# EasyEDA Pro project ICEDA_Osptek ST7306 Display Driver Board.epro

# Schematic Schematic1
Board Name: Board1; Create Date: 2025-10-27; Page Name: P1; Project Name: Ospyek ST7305 Display Driver Board; Schematic Name: Schematic1; Update Date: 2025-10-31; Company: 嘉立创EDA; Page Size: A4; Version: V1.0
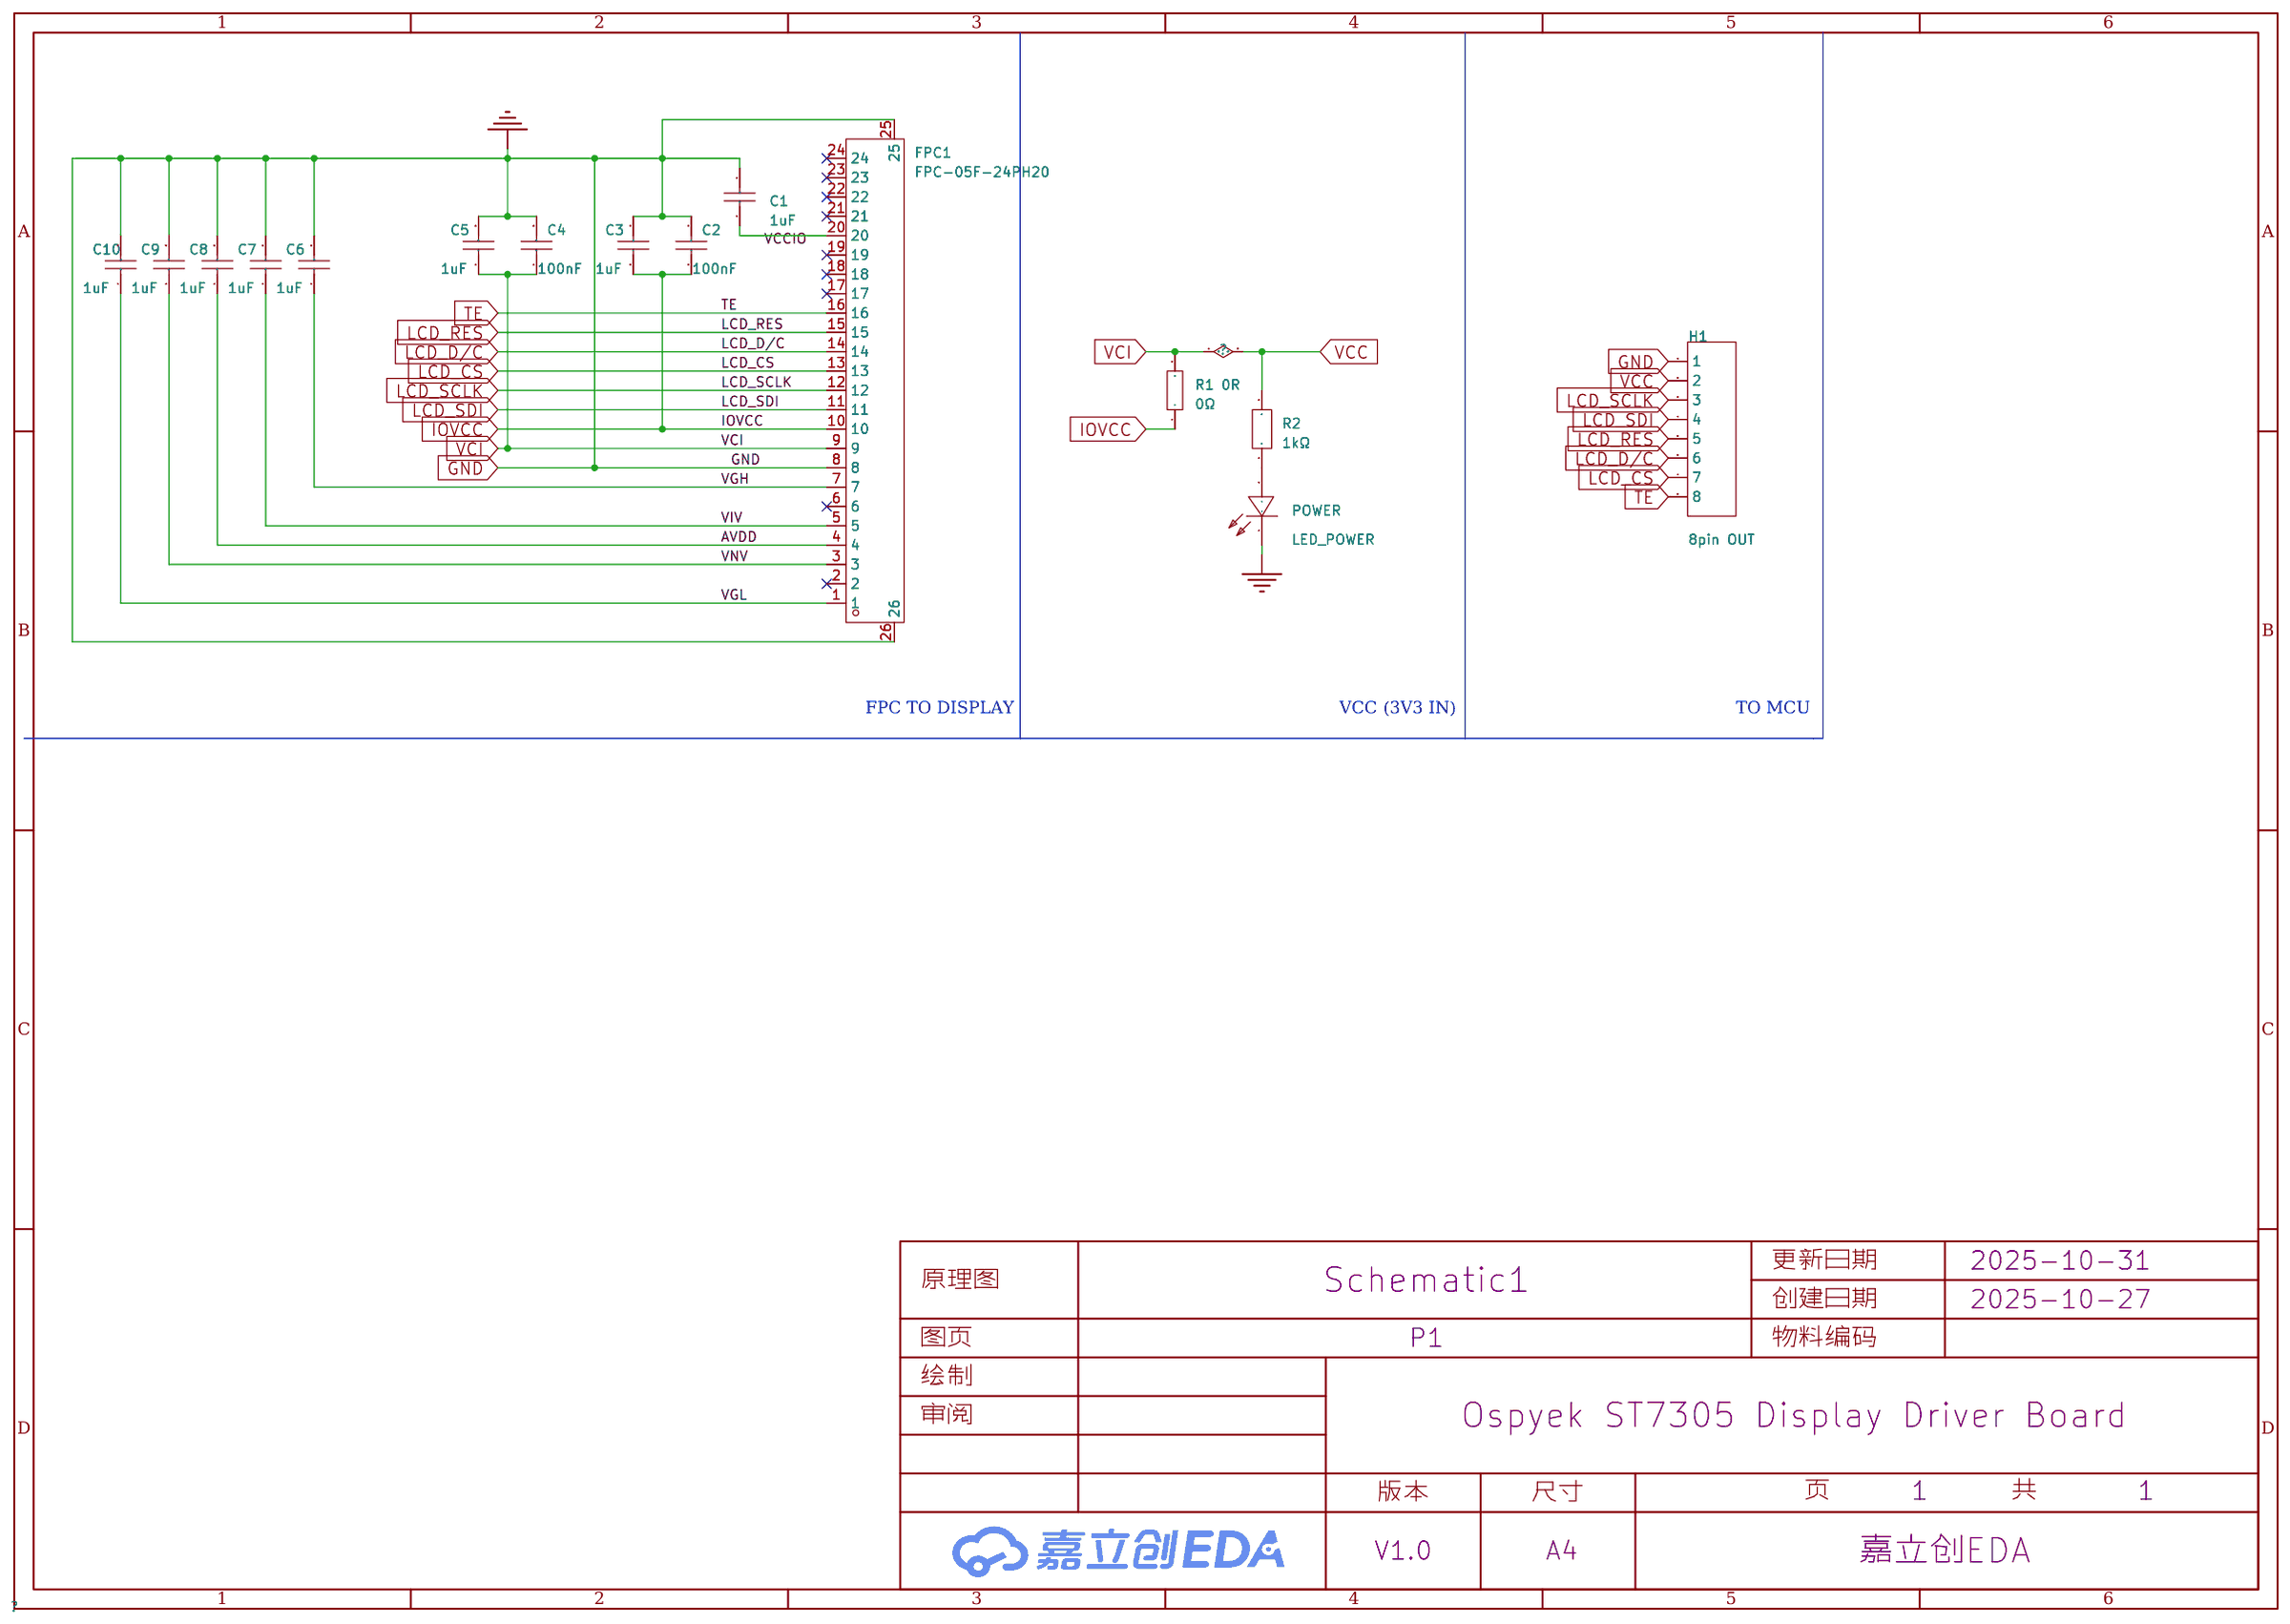
[diagram p0: schematic sheet]

## Parts
C1  1uF  [C0603]
C2  100nF  [C0603]
C3  1uF  [C0603]
C4  100nF  [C0603]
C5  1uF  [C0603]
C6  1uF  [C0603]
C7  1uF  [C0603]
C8  1uF  [C0603]
C9  1uF  [C0603]
C10  1uF  [C0603]
FPC1  FPC-05F-24PH20  [FPC-SMD_24P-P0.50_FPC-05F-24PH20]
H1  8pin OUT  [HDR-TH_8P-P2.54-V-M]
POWER  LED_POWER  [LED0603-RD-YELLOW]
R1 0R  0Ω  [R0805]
R2  1kΩ  [R0805]

## Library data of the parts
C1 C3 C5-C10 = CL10B105KA8NNNC: 容值:1uF;精度:±10%;额定电压:25V;温度系数:X7R;; LCSC Part Name: 1uF ±10% 25V; Supplier Part: C29936; Manufacturer: SAMSUNG(三星); Supplier Footprint: 0603; JLCPCB Part Class: 扩展库; Datasheet: https://item.szlcsc.com/datasheet/CL10B105KA8NNNC/30690.html; Supplier: LCSC; Tolerance: ±10%; Voltage Rating: 25V; Temperature Coefficient: X7R
C2 C4 = 0603B104K500NT: 容值:100nF;精度:±10%;额定电压:50V;温度系数:X7R;; LCSC Part Name: 100nF ±10% 50V; Supplier Part: C30926; Manufacturer: FH(风华); Supplier Footprint: 0603; JLCPCB Part Class: 扩展库; Datasheet: https://item.szlcsc.com/datasheet/0603B104K500NT/31683.html; Supplier: LCSC; Tolerance: ±10%; Voltage Rating: 50V; Temperature Coefficient: X7R
FPC1 = FPC-05F-24PH20: 锁定特性:翻盖式;触点类型:卧贴;触点数量:24P;间距:0.5mm;安装方式:下接;工作温度:-25℃~+85℃;; LCSC Part Name: 翻盖式 卧贴 P数:24P 间距:0.5mm; Supplier Part: C2856805; Manufacturer: XUNPU(讯普); Supplier Footprint: SMD,P=0.5mm,卧贴; JLCPCB Part Class: 扩展库; Datasheet: https://item.szlcsc.com/datasheet/FPC-05F-24PH20/3056903.html; Supplier: LCSC; Locking Feature: 翻盖式; Contact Type: 卧贴; Number of Contacts: 24P; Pitch: 0.5mm; Mounting Type: 下接; FFC, FCB Thickness: 0.3mm; Height Above Board: 2mm; Contact Material: 磷青铜; Contact Plating: 锡; Operating Temperature: -25℃~+85℃; Rated Voltage (Max): 50V; Current Rating (Max): 500mA
H1 = B-2100S08P-A110: 插针结构:1x8P;间距:2.54mm;行距:-;圆针/方针:-;安装方式:直插;排数:单排;总PIN位数:8P;额定电流:-;额定电压:-;配合针长度:6mm;塑高:2.54mm;端接针长度:3mm;触头材质:黄铜;触头镀层:-;工作温度:-40℃~+105℃;颜色:黑色;; LCSC Part Name: 1x8P 间距:2.54mm 直插; Supplier Part: C124381; Manufacturer: Ckmtw(灿科盟); Supplier Footprint: 插件,P=2.54mm; JLCPCB Part Class: 扩展库; Datasheet: https://item.szlcsc.com/datasheet/B-2100S08P-A110/125656.html; Supplier: LCSC; Pin Structure: 1x8P; Pitch: 2.54mm; Mounting Type: 直插; Number of Rows: 单排; Number of Pins: 8P; Length of Mating Pin: 6mm; Insulation Height: 2.54mm; Length of End Connection Pin: 3mm; Contact Material: 黄铜; Operating Temperature: -40℃~+105℃; Color: 黑色
POWER = LTST-C191KSKT: 发光颜色:黄色;正向压降(Vf):2.1V;功率:75mW;正向电流:20mA;波长:584.5nm~597nm;二极管配置:-;透镜颜色:无色透明透镜;色温:-;发光强度:104mcd;发光角度:130°;载带方式:-;工作温度:-55℃~+85℃;; LCSC Part Name: 黄灯; Supplier Part: C125100; Manufacturer: LITEON(光宝); Supplier Footprint: 0603; JLCPCB Part Class: 扩展库; Datasheet: https://item.szlcsc.com/datasheet/LTST-C191KSKT/136376.html; Supplier: LCSC; Illumination Color: 黄色; Voltage - Forward(Vf): 2.1V; Power(Watts): 75mW; Forward Current: 20mA; Wavelength - Dominant: 584.5nm~597nm; Peak Wavelength: 588nm; Lens Color: 无色透明透镜; Luminous Intensity: 104mcd; Viewing Angle: 130°; Operating Temperature: -55℃~+85℃
R1 0R = 0805W8F0000T5E: 电阻类型:厚膜电阻;阻值:0Ω;精度:±1%;功率:125mW;工作电压:150V;温度系数:±800ppm/℃;; LCSC Part Name: 0Ω ±1% 125mW 厚膜电阻; Supplier Part: C17477; Manufacturer: UNI-ROYAL(厚声); Supplier Footprint: 0805; JLCPCB Part Class: 基础库; Datasheet: https://item.szlcsc.com/datasheet/0805W8F0000T5E/18165.html; Supplier: LCSC; Type: 厚膜电阻; Tolerance: ±1%; Power(Watts): 125mW; Voltage-Supply(Max): 150V; Temperature Coefficient: ±800ppm/℃; Operating Temperature: -55℃~+155℃
R2 = FRR0805J102 TS: 电阻类型:厚膜电阻;阻值:1kΩ;精度:±5%;功率:125mW;工作电压:150V;温度系数:±100ppm/℃;; LCSC Part Name: 厚膜电阻 0805 1KΩ ±5% 125mW; Supplier Part: C49196827; Manufacturer: FOJAN(富捷); Supplier Footprint: 0805; JLCPCB Part Class: 扩展库; Datasheet: https://item.szlcsc.com/datasheet/FRR0805J102%2520TS/51599075.html; Supplier: LCSC; Type: 厚膜电阻; Tolerance: ±5%; Power(Watts): 125mW; Voltage-Supply(Max): 150V; Temperature Coefficient: ±100ppm/℃; Operating Temperature: -55℃~+155℃

## Nets
AVDD: C8.1 FPC1.4
GND: C1.2 C2.2 C3.2 C4.2 C5.2 C6.2 C7.2 C8.2 C9.2 C10.2 FPC1.8 FPC1.25 FPC1.26 H1.1 POWER.1(-)
VCC: C4.1 C5.1 FPC1.9 H1.2 R1 0R.2 R2.2
VCCIO: C1.1 FPC1.20
IOVCC: C2.1 C3.1 FPC1.10 R1 0R.1
LCD_CS: FPC1.13 H1.7
LCD_D/C: FPC1.14 H1.6
LCD_RES: FPC1.15 H1.5
LCD_SCLK: FPC1.12 H1.3
LCD_SDI: FPC1.11 H1.4
TE: FPC1.16 H1.8
VGH: C6.1 FPC1.7
VGL: C10.1 FPC1.1
VIV: C7.1 FPC1.5
VNV: C9.1 FPC1.3
$1N4245: POWER.2(+) R2.1

Not connected (* = marked no-connect by the designer): FPC1 2* 6* 17* 18* 19* 21* 22* 23* 24*

## Notes on the sheet
- FPC TO DISPLAY
- VCC (3V3 IN)
- TO MCU

# Board PCB1
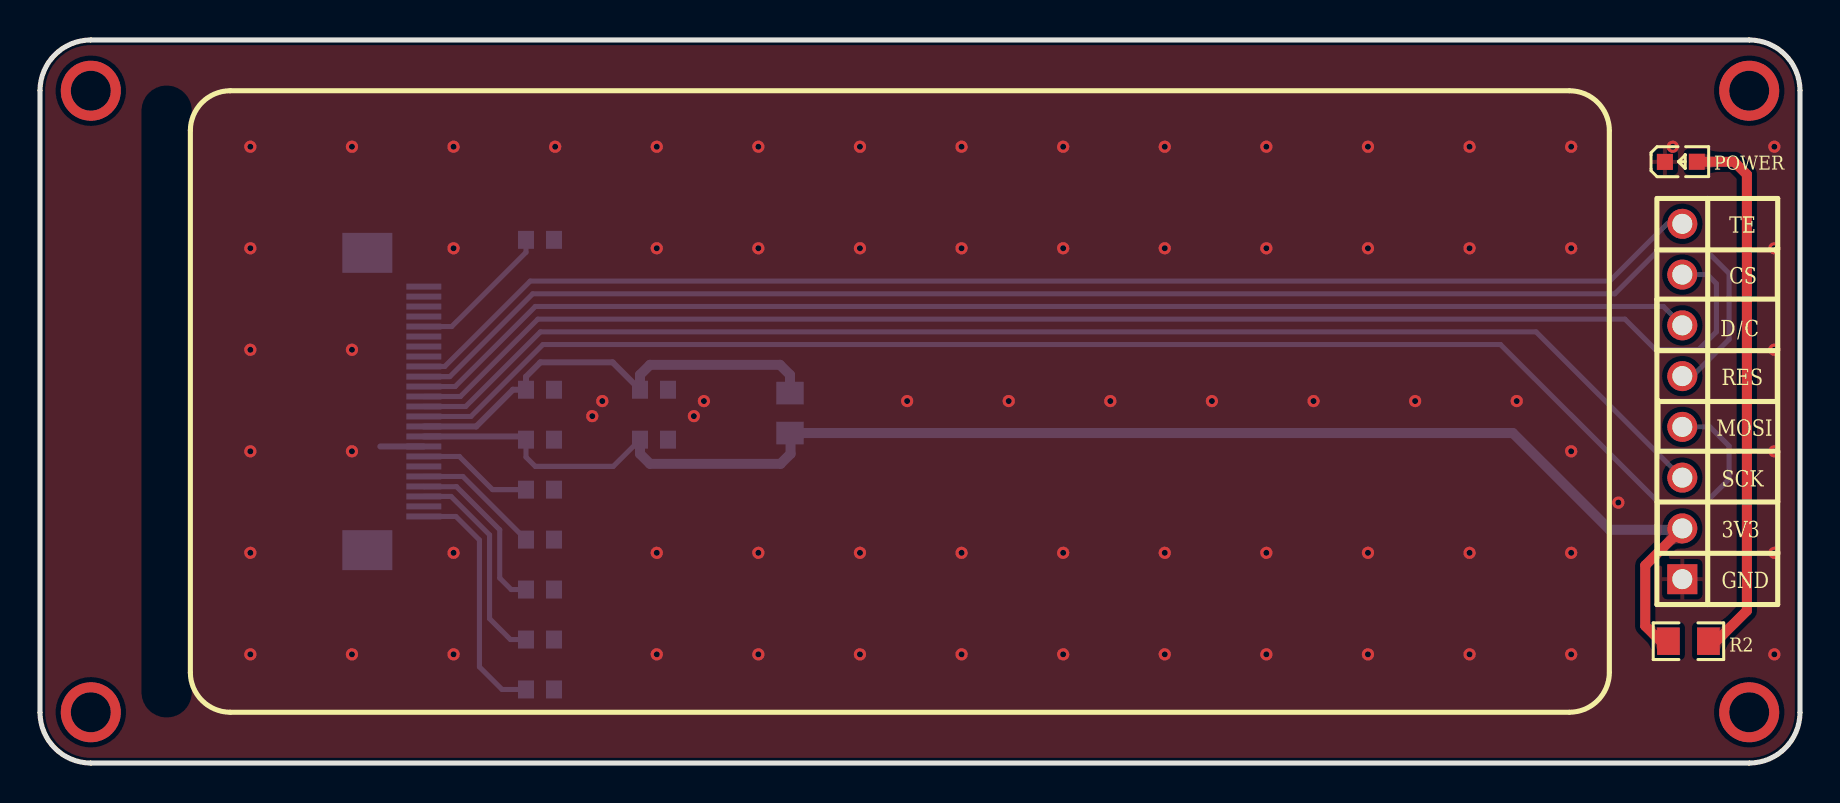
[diagram p1: board, top side]
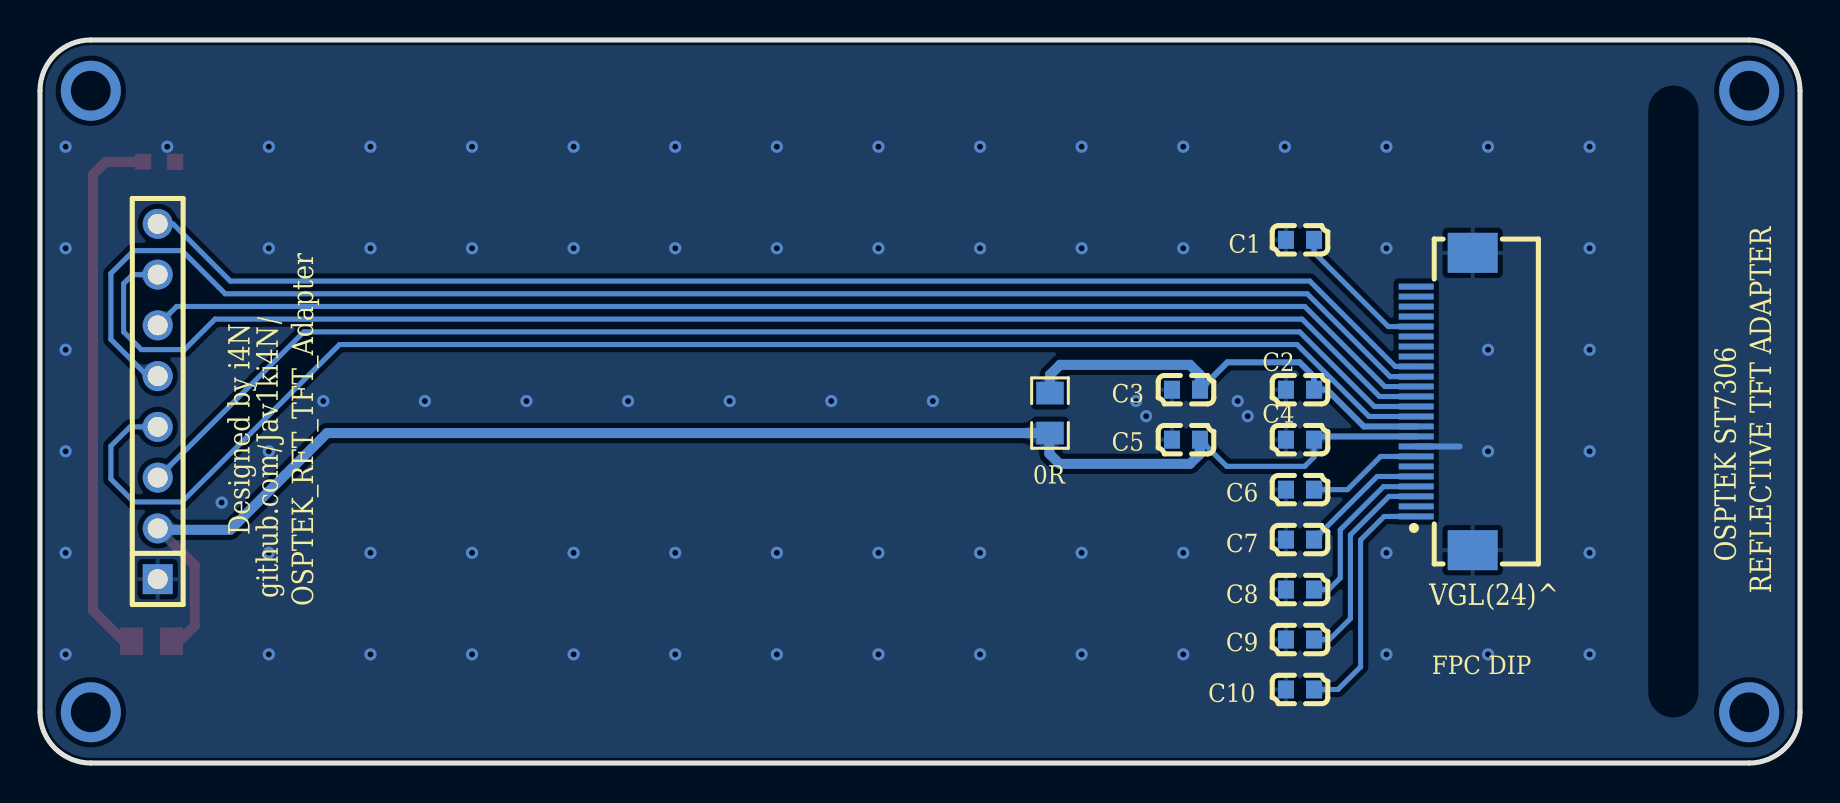
[diagram p2: board, bottom side, seen from below]

Outline 88 x 36.18 mm; copper layers: Top Layer, Bottom Layer. Coordinates in mm from the lower left corner of the outline.
Outline path: 0,33.64 0,2.54 arc(0.74,0.74) 2.54,0 85.46,0 arc(87.26,0.74) 88,2.54 88,33.64 arc(87.26,35.44) 85.46,36.18 2.54,36.18 arc(0.74,35.44) 0,33.64
Stack: Top Layer 0.035mm / Dielectric1 1.51mm FR4 er 4.5 / Bottom Layer 0.035mm

## Design rules (mm)
template: JLCPCB Capability(Two Layers Board)
spacing copperThickness1oz (default): track to track 0.102, other pairs 0.152 to 0.3
spacing copperThickness2oz: track to track 0.203, other pairs 0.152 to 0.3
track width copperThickness1oz (default): min 0.127, default 0.254, max 2.54
track width copperThickness2oz: min 0.203, default 0.254, max 2.54
differential pair differentialPair (default): width min 0.127, default 0.254, max 2.54; gap min 0.152, default 0.152
via viaSize (default): diameter min 0.5, default 0.61, max 10; hole min 0.3, default 0.305, max 6.3

## Placement (name value [footprint] x y rotation side)
0R  -  [R0805]  37.5 17.51 270 bottom
C1  1uF  [C0603]  25 26.18 0 bottom
C2  100nF  [C0603]  25 18.68 0 bottom
C3  1uF  [C0603]  30.7 18.68 0 bottom
C4  100nF  [C0603]  25 16.18 0 bottom
C5  1uF  [C0603]  30.7 16.18 0 bottom
C6  1uF  [C0603]  25 13.68 0 bottom
C7  1uF  [C0603]  25 11.18 0 bottom
C8  1uF  [C0603]  25 8.68 0 bottom
C9  1uF  [C0603]  25 6.18 0 bottom
C10  1uF  [C0603]  25 3.68 0 bottom
FPC DIP
  -  [FPC-SMD_24P-P0.50_FPC-05F-24PH20]  17.65 18.09 90 bottom
H1  8pin OUT  [HDR-TH_8P-P2.54-V-M]  82.12 18.09 90 bottom
POWER  LED_POWER  [LED0603-RD-YELLOW]  82.04 30.08 0 top
R2  1kΩ  [R0805]  82.42 6.1 180 top

## Footprints (pads in the part's own frame, mm; a bottom-side part is the same pattern mirrored in y, then rotated)
C0603
  rect 0.8x0.9 smd: 1(-0.7,0) 2(0.7,0)
FPC-SMD_24P-P0.50_FPC-05F-24PH20
  rect 0.3x1.75 smd: 1(-5.753,1.536) 2(-5.25,1.537) 3(-4.75,1.537) 4(-4.25,1.537) 5(-3.75,1.537) 6(-3.25,1.537) 7(-2.75,1.537) 8(-2.25,1.537) 9(-1.75,1.537) 10(-1.25,1.537) 11(-0.75,1.537) 12(-0.25,1.537) 13(0.25,1.537) 14(0.75,1.537) 15(1.244,1.537) 16(1.752,1.537) 17(2.25,1.537) 18(2.75,1.537) 19(3.25,1.537) 20(3.75,1.537) 21(4.25,1.537) 22(4.75,1.537) 23(5.25,1.537) 24(5.75,1.537)
  rect 2x2.5 smd: 25(7.44,-1.288) 26(-7.44,-1.288)
HDR-TH_8P-P2.54-V-M
  rect 1.5x1.5 hole 1: 1(-8.89,0)
  round 1.5 hole 1: 2(-6.35,0) 3(-3.81,0) 4(-1.27,0) 5(1.27,0) 6(3.81,0) 7(6.35,0) 8(8.89,0)
LED0603-RD-YELLOW
  rect 0.8x0.8 smd: 1(-0.799,-0.004) 2(0.799,0.004)
R0805
  rect 1.133x1.377 smd: 1(-1,0) 2(1,0)

## Nets
AVDD: C8.1 FPC DIP
.4
GND: C1.2 C2.2 C3.2 C4.2 C5.2 C6.2 C7.2 C8.2 C9.2 C10.2 FPC DIP
.8 FPC DIP
.25 FPC DIP
.26 H1.1 POWER.1
VCC: 0R.2 C4.1 C5.1 FPC DIP
.9 H1.2 R2.2
VCCIO: C1.1 FPC DIP
.20
IOVCC: 0R.1 C2.1 C3.1 FPC DIP
.10
LCD_CS: FPC DIP
.13 H1.7
LCD_D/C: FPC DIP
.14 H1.6
LCD_RES: FPC DIP
.15 H1.5
LCD_SCLK: FPC DIP
.12 H1.3
LCD_SDI: FPC DIP
.11 H1.4
TE: FPC DIP
.16 H1.8
VGH: C6.1 FPC DIP
.7
VGL: C10.1 FPC DIP
.1
VIV: C7.1 FPC DIP
.5
VNV: C9.1 FPC DIP
.3
$1N4245: POWER.2 R2.1

Pads without a net: FPC DIP
 2 6 17 18 19 21 22 23 24

## Via types
v1: diameter 3, hole 2, Top Layer to Bottom Layer, 4 vias
v2: diameter 0.61, hole 0.305, Top Layer to Bottom Layer, 75 vias

## Routing (per net, layer and track width the routed paths; a pad name or vN(x,y) marks a point on that pad's centre or on a via; arc(x,y) is an arc through that point)
AVDD: length 8.7
  Bottom Layer w0.254: FPC DIP
.4 19.2,13.83 20.83,13.83 22.99,11.67 22.99,9.26 23.56,8.68 C8.1
GND: length 2.2
  Bottom Layer w0.3: FPC DIP
.8 17.02,15.84
  vias: v2(10.52,30.84) v2(10.52,25.76) v2(10.52,20.68) v2(10.52,15.6) v2(10.52,10.52) v2(10.52,5.44) v2(15.6,30.84) v2(15.6,20.68) v2(15.6,15.6) v2(15.6,5.44) v2(20.68,30.84) v2(20.68,25.76) v2(20.68,10.52) v2(20.68,5.44) v2(25.76,30.84) v2(27.61,17.36) v2(28.12,18.11) v2(30.84,30.84) v2(30.84,25.76) v2(30.84,10.52) v2(30.84,5.44) v2(32.69,17.36) v2(33.2,18.11) v2(35.92,30.84) v2(35.92,25.76) v2(35.92,10.52) v2(35.92,5.44) v2(41,30.84) v2(41,25.76) v2(41,10.52) v2(41,5.44) v2(43.36,18.11) v2(46.08,30.84) v2(46.08,25.76) v2(46.08,10.52) v2(46.08,5.44) v2(48.44,18.11) v2(51.16,30.84) v2(51.16,25.76) v2(51.16,10.52) v2(51.16,5.44) v2(53.52,18.11) v2(56.24,30.84) v2(56.24,25.76) v2(56.24,10.52) v2(56.24,5.44) v2(58.6,18.11) v2(61.32,30.84) v2(61.32,25.76) v2(61.32,10.52) v2(61.32,5.44) v2(63.68,18.11) v2(66.4,30.84) v2(66.4,25.76) v2(66.4,10.52) v2(66.4,5.44) v2(68.76,18.11) v2(71.48,30.84) v2(71.48,25.76) v2(71.48,10.52) v2(71.48,5.44) v2(73.84,18.11) v2(76.56,30.84) v2(76.56,25.76) v2(76.56,15.6) v2(76.56,10.52) v2(76.56,5.44) v2(78.92,13.03) v2(81.64,30.84) v2(86.72,30.84) v2(86.72,25.76) v2(86.72,20.68) v2(86.72,15.6) v2(86.72,10.52) v2(86.72,5.44)
VCC: length 76.1
  Top Layer w0.5: 82.11,11.74 80.26,9.89 80.26,6.86 81.42,5.7
  Bottom Layer w0.254: C5.1 28.66,14.84 24.77,14.84 24.3,15.31 C4.1
  Bottom Layer w0.3: C4.1 24.14,16.34 FPC DIP
.9
  Bottom Layer w0.5: H1.2 82.04,11.67 78.49,11.67 73.64,16.51 0R.2 37.53,16.48 37.53,15.47 37.03,14.97 30.5,14.97 30,15.47 C5.1
VCCIO: length 7.3
  Bottom Layer w0.254: C1.1 24.3,25.56 20.58,21.84 FPC DIP
.20
(no net):
  vias: v1(2.54,33.64) v1(2.54,2.54) v1(85.46,33.64) v1(85.46,2.54)
IOVCC: length 22.7
  Bottom Layer w0.3: C3.1 28.63,20.05 25.02,20.05 24.3,19.33 C2.1 23.65,18.68 21.81,16.84 FPC DIP
.10
  Bottom Layer w0.5: C3.1 30,19.42 30.5,19.92 37,19.92 37.5,19.42 0R.1
LCD_CS: length 71.5
  Bottom Layer w0.254: FPC DIP
.13 21.02,18.34 24.89,22.21 79.25,22.21 80.77,20.69 82.93,20.69 83.82,21.58 83.82,23.99 83.37,24.44 H1.7
LCD_D/C: length 65
  Bottom Layer w0.254: H1.6 81.17,22.85 24.77,22.85 20.76,18.84 FPC DIP
.14
LCD_RES: length 74.7
  Bottom Layer w0.254: H1.5 82.62,19.36 84.46,21.2 84.46,24.5 83.31,25.64 80.9,25.64 78.74,23.48 24.64,23.48 20.49,19.33 FPC DIP
.15
LCD_SCLK: length 67.5
  Bottom Layer w0.254: FPC DIP
.12 21.28,17.84 25.02,21.58 74.8,21.58 82.1,14.28 H1.3
LCD_SDI: length 74.9
  Bottom Layer w0.254: H1.4 83.5,16.82 84.46,15.86 84.46,14.21 83.31,13.07 80.9,13.07 73.03,20.94 25.15,20.94 21.55,17.34 FPC DIP
.11
TE: length 65.9
  Bottom Layer w0.254: H1.8 81.35,26.98 78.49,24.12 24.51,24.12 20.24,19.84 FPC DIP
.16
VGH: length 5.8
  Bottom Layer w0.254: C6.1 22.63,13.68 20.97,15.34 FPC DIP
.7
VGL: length 12.4
  Bottom Layer w0.254: C10.1 23.1,3.68 21.97,4.81 21.97,11.16 20.8,12.34 FPC DIP
.1
VIV: length 6.4
  Bottom Layer w0.254: C7.1 21.14,14.34 FPC DIP
.5
VNV: length 10.5
  Bottom Layer w0.254: FPC DIP
.3 20.55,13.34 22.48,11.42 22.48,7.22 23.52,6.18 C9.1
$1N4245: length 27.3
  Top Layer w0.5: POWER.2 82.84,30.08 84.71,30.08 85.34,29.45 85.34,7.62 83.42,5.7

## Copper pours and planes (outline as drawn; the poured copper is in the pictures)
GND on Top Layer: -6.6,43.17 95.5,43.17 95.5,-7.51 -6.6,-7.51
GND on Bottom Layer: -5.21,42.4 90.55,42.4 90.55,-8.27 -5.21,-8.27

Small or netless copper shapes (teardrops, artwork), in the pictures only: 4 on Top Layer, 26 on Bottom Layer

## Text on the board
Bottom Silkscreen Layer: OSPTEK ST7306 / REFLECTIVE TFT ADAPTER | github.com/Jav1ki4N/ / OSPTEK_RFT_TFT_Adapter | Designed by i4N | VGL(24)^
Document Layer: PCB Width = FR-4 width + EVA form width / = 2.6mm | Length of FPC inserted in the dip / = 3.5mm | MAX Avaliable FPC length / = 14.3 - (3.14*2.6*0.5) - 3.5 / = 6.718mm | MIN Avaliable FPC length is when the / radius  = 2mm, as it's the length of the / open area. / Result: 4.52mm | (MAX+MIN)/2 = 5.619mm / Take this as the FPC length for application
Top Silkscreen Layer: MOSI | D/C | RES | SCK | 3V3 | GND | TE | CS
